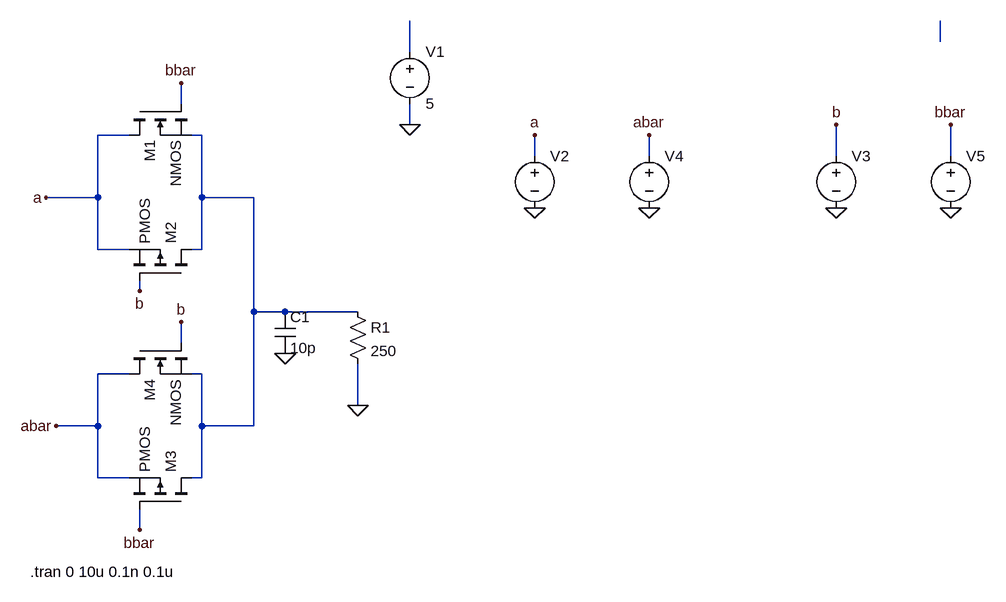
[diagram p0: schematic xor gate tg.asc]
xor gate tg.asc, the LTspice schematic file:
Version 4.1
SHEET 1 1748 680
WIRE 1312 -400 1312 -432
WIRE 496 -384 496 -432
WIRE 144 -304 144 -336
WIRE 496 -272 496 -304
WIRE 64 -256 16 -256
WIRE 176 -256 160 -256
WIRE 688 -224 688 -256
WIRE 864 -224 864 -256
WIRE 1152 -224 1152 -272
WIRE 1328 -224 1328 -272
WIRE 16 -160 16 -256
WIRE 16 -160 -64 -160
WIRE 176 -160 176 -256
WIRE 256 -160 176 -160
WIRE 16 -80 16 -160
WIRE 64 -80 16 -80
WIRE 176 -80 176 -160
WIRE 176 -80 160 -80
WIRE 80 -16 80 -32
WIRE 256 16 256 -160
WIRE 304 16 256 16
WIRE 416 16 304 16
WIRE 144 64 144 32
WIRE 64 112 16 112
WIRE 176 112 160 112
WIRE 416 160 416 96
WIRE 16 192 16 112
WIRE 16 192 -48 192
WIRE 176 192 176 112
WIRE 256 192 256 16
WIRE 256 192 176 192
WIRE 16 272 16 192
WIRE 64 272 16 272
WIRE 176 272 176 192
WIRE 176 272 160 272
WIRE 80 352 80 320
FLAG 496 -272 0
FLAG 688 -144 0
FLAG 1152 -144 0
FLAG 688 -256 a
FLAG 1152 -272 b
FLAG -64 -160 a
FLAG -48 192 abar
FLAG 864 -144 0
FLAG 1328 -144 0
FLAG 864 -256 abar
FLAG 1328 -272 bbar
FLAG 144 -336 bbar
FLAG 80 352 bbar
FLAG 80 -16 b
FLAG 144 32 b
FLAG 304 80 0
FLAG 416 160 0
SYMBOL voltage 496 -400 R0
WINDOW 123 0 0 Left 0
WINDOW 39 0 0 Left 0
SYMATTR InstName V1
SYMATTR Value 5
SYMBOL voltage 688 -240 R0
WINDOW 3 24 96 Invisible 2
WINDOW 123 0 0 Left 0
WINDOW 39 0 0 Left 0
SYMATTR Value PULSE(0 5 0 0.1n 0.1n 1u 2u 10)
SYMATTR InstName V2
SYMBOL voltage 1152 -240 R0
WINDOW 3 24 96 Invisible 2
WINDOW 123 0 0 Left 0
WINDOW 39 0 0 Left 0
SYMATTR Value PULSE(0 5 0 0.1n 0.1n 2u 4u 10)
SYMATTR InstName V3
SYMBOL voltage 864 -240 R0
WINDOW 3 24 96 Invisible 2
WINDOW 123 0 0 Left 0
WINDOW 39 0 0 Left 0
SYMATTR Value PULSE(0 5 1u 0.1n 0.1n 1u 2u 10)
SYMATTR InstName V4
SYMBOL voltage 1328 -240 R0
WINDOW 3 24 96 Invisible 2
WINDOW 123 0 0 Left 0
WINDOW 39 0 0 Left 0
SYMATTR Value PULSE(0 5 2u 0.1n 0.1n 2u 4u 10)
SYMATTR InstName V5
SYMBOL cap 288 16 R0
SYMATTR InstName C1
SYMATTR Value 10p
SYMBOL nmos 64 -304 M90
SYMATTR InstName M1
SYMBOL nmos 64 64 M90
SYMATTR InstName M4
SYMBOL pmos 160 -32 M270
SYMATTR InstName M2
SYMBOL pmos 160 320 M270
SYMATTR InstName M3
SYMBOL res 400 0 R0
SYMATTR InstName R1
SYMATTR Value 250
TEXT -88 416 Left 2 !.tran 0 10u 0.1n 0.1u

The netlist it stands for:
* xor gate tg.asc
V1 N002 0 5
V2 a 0 PULSE(0 5 0 0.1n 0.1n 1u 2u 10)
V3 b 0 PULSE(0 5 0 0.1n 0.1n 2u 4u 10)
V4 abar 0 PULSE(0 5 1u 0.1n 0.1n 1u 2u 10)
V5 bbar 0 PULSE(0 5 2u 0.1n 0.1n 2u 4u 10)
C1 N003 0 10p
M1 a bbar N003 N003 NMOS
M4 abar b N003 N003 NMOS
M2 N003 b a a PMOS
M3 N003 bbar abar abar PMOS
R1 N003 0 250
.model NMOS NMOS
.model PMOS PMOS
.lib standard.mos
.tran 0 10u 0.1n 0.1u
.backanno
.end